# EAGLE schematic Raspberry Pi (EAGLE 9.6.2)
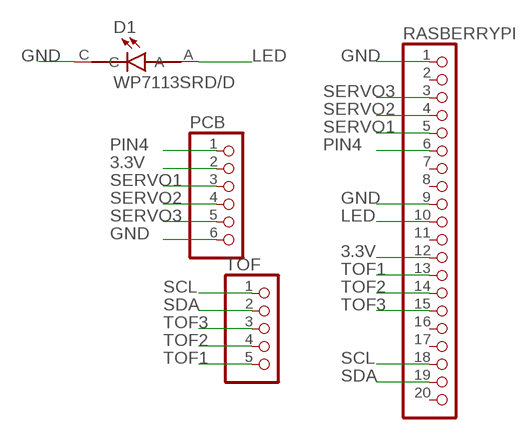
[diagram p0: schematic, sheet 1]

## Parts
D1  WP7113SRD/D  [LED_WP7113SRD/D]
PCB  PINHD-1X6  [1X06]
RASBERRYPI  PINHD-1X20  [1X20]
TOF  PINHD-1X5  [1X05]

## Nets
3.3V: PCB.2 RASBERRYPI.12
GND: D1.C PCB.6 RASBERRYPI.1 RASBERRYPI.9
LED: D1.A RASBERRYPI.10
PIN4: PCB.1 RASBERRYPI.6
SCL: RASBERRYPI.18 TOF.1
SDA: RASBERRYPI.19 TOF.2
SERVO1: PCB.3 RASBERRYPI.5
SERVO2: PCB.4 RASBERRYPI.4
SERVO3: PCB.5 RASBERRYPI.3
TOF1: RASBERRYPI.13 TOF.5
TOF2: RASBERRYPI.14 TOF.4
TOF3: RASBERRYPI.15 TOF.3
Unconnected: RASBERRYPI.2 RASBERRYPI.7 RASBERRYPI.8 RASBERRYPI.11 RASBERRYPI.16 RASBERRYPI.17 RASBERRYPI.20

## Library data of the parts
D1 = WP7113SRD_D:WP7113SRD/D: Red T-1 3/4 5 mm 30° Tinted Diffused 600 mcd 1.85 V Solid State LED Through Hole Check availability <https://pricing.snapeda.com/parts/WP7113SRD/D/Kingbright/view-part?ref=eda>; AVAILABILITY: In Stock; CHECK_PRICES: https://www.snapeda.com/parts/WP7113SRD/D/Kingbright/view-part/?ref=eda; DESCRIPTION: Red 640nm LED Indication - Discrete 1.85V Radial; MF: Kingbright; MP: WP7113SRD/D; PACKAGE: Radial Kingbright; PRICE: None; SNAPEDA_LINK: https://www.snapeda.com/parts/WP7113SRD/D/Kingbright/view-part/?ref=snap
PCB = pinhead:PINHD-1X6: PIN HEADER
RASBERRYPI = pinhead:PINHD-1X20: PIN HEADER
TOF = pinhead:PINHD-1X5: PIN HEADER